# EAGLE design Motor_V1.0 (EAGLE 9.4.1)
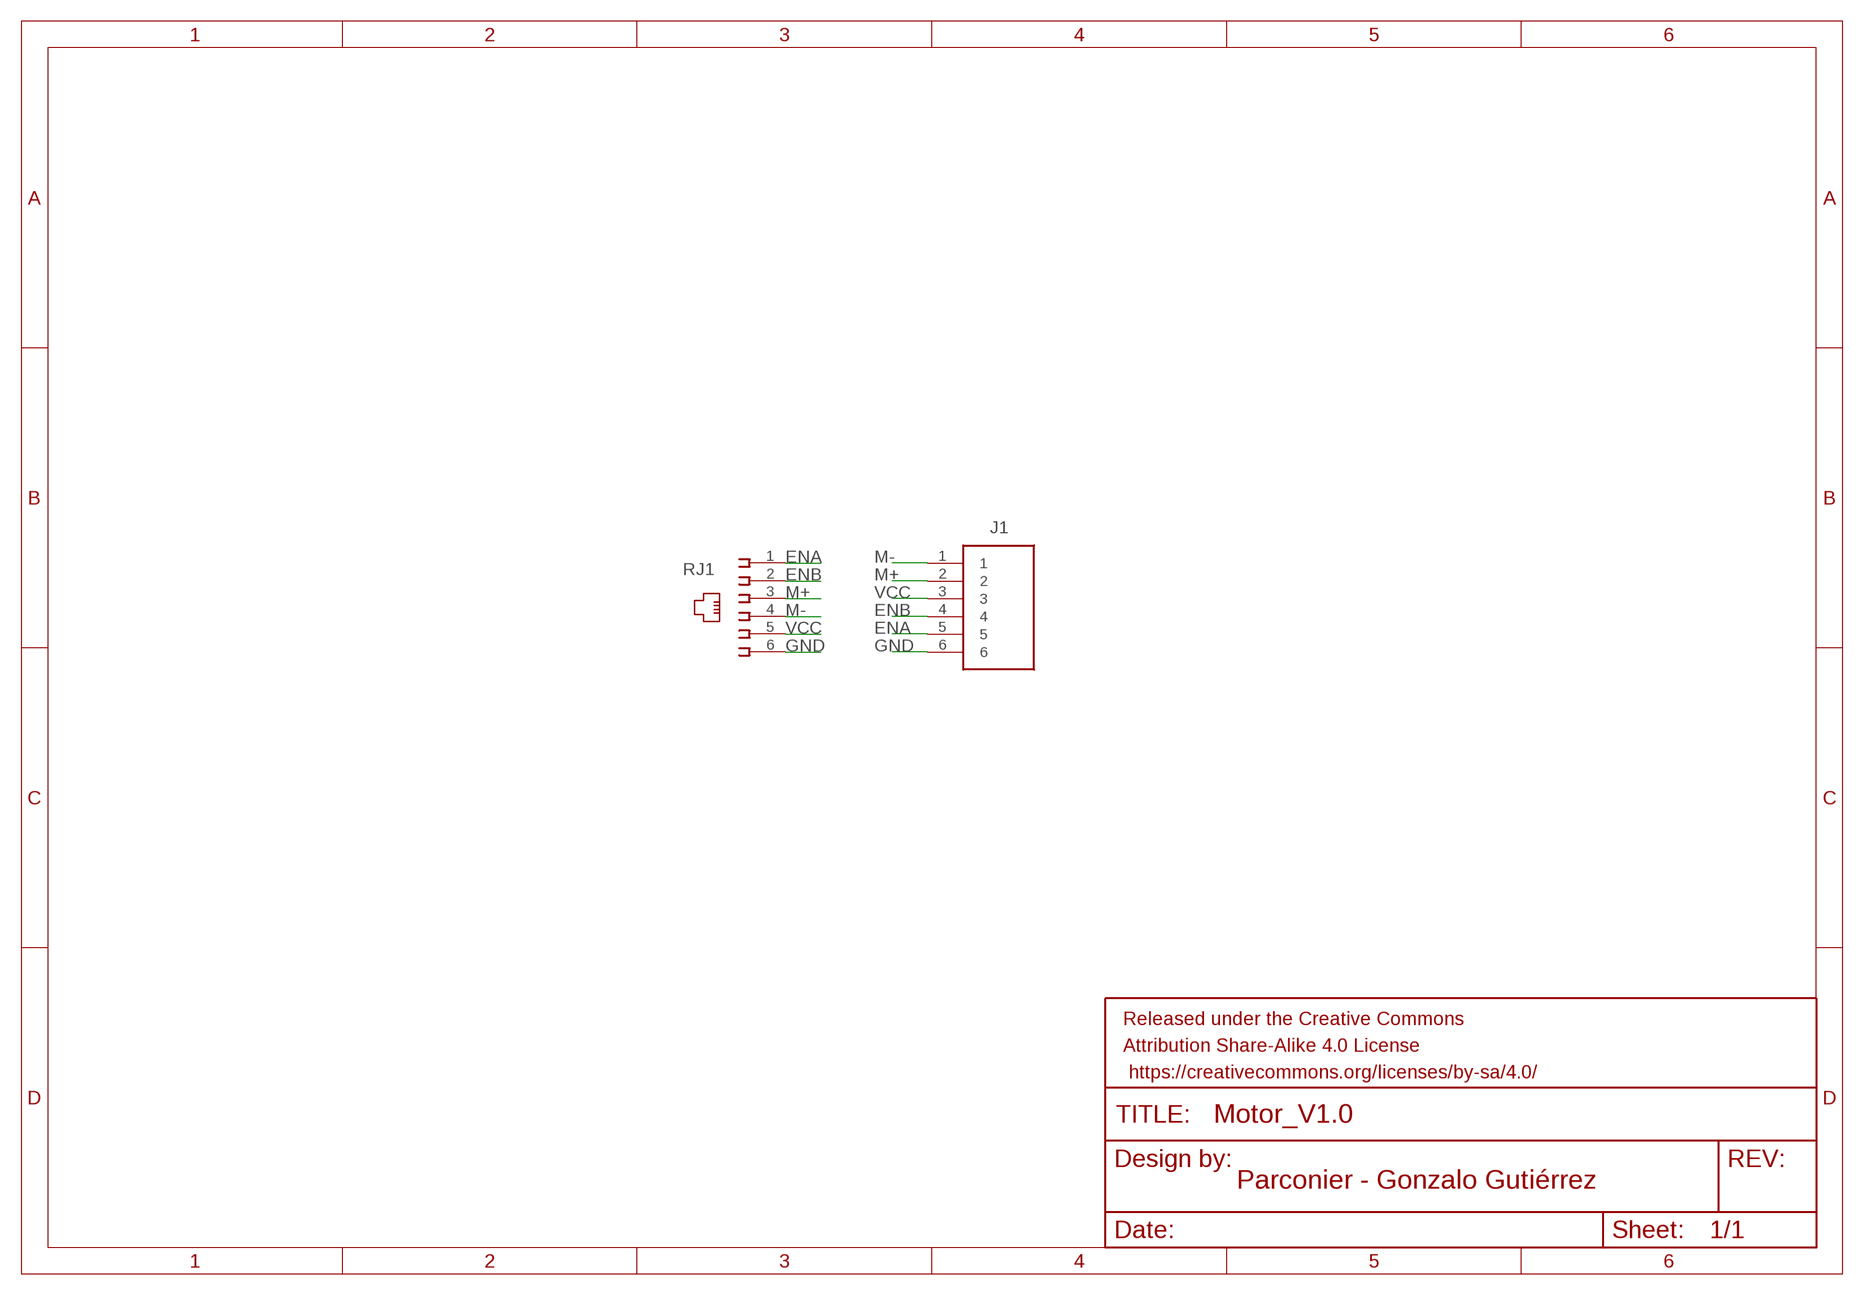
[diagram p0: schematic, sheet 1]

## Parts
J1  B6B-ZR  [SHDR6W50P0X150_1X6_1050X350X45]
RJ1  615006138421  [615006138421]

## Nets
ENA: J1.5 RJ1.1
ENB: J1.4 RJ1.2
GND: J1.6 RJ1.6
M+: J1.2 RJ1.3
M-: J1.1 RJ1.4
VCC: J1.3 RJ1.5

## Library data of the parts
J1 = B6B-ZR:B6B-ZR: CONN HEADER ZH TOP 6POS 1.5MM Source: Datasheet <http://www.jst-mfg.com/product/pdf/eng/eZH.pdf>; DESCRIPTION: CONN HEADER ZH TOP 6POS 1.5MM; HEIGHT: 4.5mm; MANUFACTURER_NAME: JST (JAPAN SOLDERLESS TERMINALS); MANUFACTURER_PART_NUMBER: B6B-ZR; MPN: B6B-ZR(LF)(SN)
RJ1 = 615006138421:615006138421: HORIZONTAL PLASTIC 6P6C MODULAR JACK TAP UP Source: Datasheet <http://docs-europe.electrocomponents.com/webdocs/0f88/0900766b80f88670.pdf>; DESCRIPTION: HORIZONTAL PLASTIC 6P6C MODULAR JACK TAP UP; HEIGHT: mm; MANUFACTURER_NAME: W&uuml;rth Elektronik; MANUFACTURER_PART_NUMBER: 615006138421; MPN: 54601-906WPLF; RS_PART_NUMBER: 7350282; SUPPLIER_NAME: RS

## Board
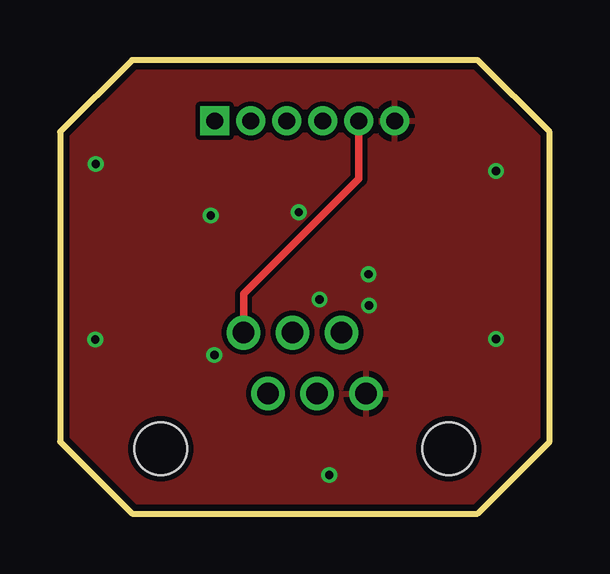
[diagram p1: board, top side]
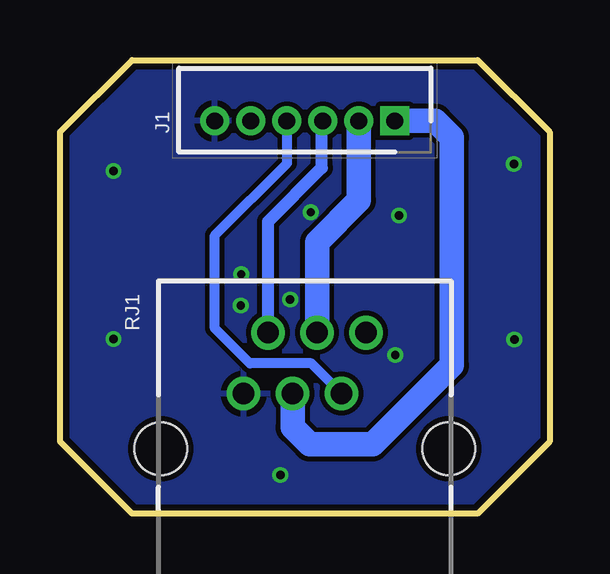
[diagram p2: board, bottom side, seen from below]

Size 20.4 x 18.9 mm. Coordinates in mm from the lower left corner, seen from the top.
Outline: 0,15.9 0,3 3,0 17.4,0 20.4,3 20.4,15.9 17.4,18.9 3,18.9 0,15.9
Copper layers (1*16): Top 0.035mm / dielectric 1.5mm / Bottom 0.035mm
Design rules "SeeedStudio_2layer_DRU_no_angle_20140221": minimum track width 6mil, minimum drill 12mil, track to track 6mil, track to pad 6mil, pad to pad 6mil, via to via 6mil, smd to smd 0mil, copper to edge 10mil, drill to drill 10mil, minimum pad ring 10mil, minimum via ring 6mil, stop-mask expansion 2mil, vias tented up to drill 100mil, thermal gap 10mil

### Footprints (pad centres in the part's own frame; a part is rotated, then mirrored left to right if it is on the bottom)
SHDR6W50P0X150_1X6_1050X350X45 = drill 0.7 pad 1.1 square: 1 3.75,0 | drill 0.7 pad 1.1: 2 2.25,0; 3 0.75,0; 4 -0.75,0; 5 -2.25,0; 6 -3.75,0
615006138421 = drill 0.9 pad 1.4: 1 2.55,4.84; 2 1.53,2.3; 3 0.51,4.84; 4 -0.51,2.3; 5 -1.53,4.84; 6 -2.55,2.3 | hole 2.2: -6,0; 6,0

### Placement (x,y rotation side)
J1  10.2,16.36 0 bottom
RJ1  10.2,2.7 0 bottom

### Tracks (layer width: path | path; a pad name or v marks a point on that pad's centre or on a via)
ENA
  Top 0.305: RJ1.1 7.65,9.15 12.45,13.95 J1.5
ENB
  Bottom 0.406: RJ1.2 9.93,6.26 12.49,6.26 13.95,7.72 13.95,11.59 10.94,14.6 J1.4
GND  (via drill 0.35)
  other vias: 1.49,14.56 18.17,14.28 18.17,7.28 11.22,1.6 6.28,12.41 6.43,6.61 1.47,7.25 12.85,9.97 12.87,8.68 10.81,8.93 9.95,12.55
  pour Top (isolate 0.2): 0,18.9 20.4,18.9 20.4,0 0,0
  pour Bottom (isolate 0.2): 0,18.9 0,0 20.4,0 20.4,18.9
M+
  Bottom 1.016: RJ1.3 9.69,11.31 7.95,13.05 J1.2
M-
  Bottom 1.016: RJ1.4 10.71,3.59 10,2.88 7.37,2.88 4.07,6.18 4.07,15.68 4.76,16.37 J1.1
VCC
  Bottom 0.508: RJ1.5 11.73,12.17 9.49,14.41 9.49,16.32 J1.3